# Altium schematic sheet Memory.SchDoc
size A4; SheetNumber: 7; SheetTotal: 9
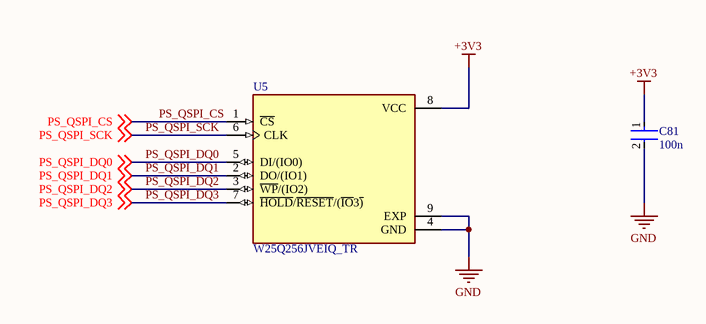
[diagram p0: Memory.SchDoc]

## Parts
C81  100n  [FP-CC0603-DA-MFG]
U5  W25Q256JVEIQ_TR  [SON127P600X800X80-9N]

## Nets
+3V3: C81.1 U5.8(VCC)
GND: C81.2 U5.4(GND) U5.9(EXP)
PS_QSPI_CS: U5.1(~{CS}) ; off-sheet PS_QSPI_CS
PS_QSPI_DQ0: U5.5(DI/(IO0)) ; off-sheet PS_QSPI_DQ0
PS_QSPI_DQ1: U5.2(DO/(IO1)) ; off-sheet PS_QSPI_DQ1
PS_QSPI_DQ2: U5.3(~{WP}/(IO2)) ; off-sheet PS_QSPI_DQ2
PS_QSPI_DQ3: U5.7(~{HOLD}/~{RESET}/(~{IO}3~{)}) ; off-sheet PS_QSPI_DQ3
PS_QSPI_SCK: U5.6(CLK) ; off-sheet PS_QSPI_SCK

## Library data of the parts
C81 = CMP-2100-03601-2: CAP CER 0.1UF 50V X7R 0603; Manufacturer: YAGEO; Manufacturer Part Number: CC0603KRX7R9BB104; Material: Ceramic; Capacitance: 100 nF; Temperature Coefficient: 15%; Tolerance: 0.1; Value: 100 nF; Height: 0.9mm; Voltage: 50 V; ComponentLink2Description: Datasheet; Device Class L2: Capacitors; Temperature Range High: +125°C; Category: Cap; Footprint Url: http://www.yageo.com/exep/pages/download/literatures/UPY-C_GEN_24.pdf; ComponentLink2URL: http://www.yageo.com/documents/recent/UPY-GPHC_X7R_6.3V-to-50V_18.pdf; Package: CC0603-DA; Temperature: -55°C to +125°C; Voltage Rating: 50 V; Temperature Characteristic: X7R; Device Class L1: Passive Components; Temperature Range Low: -55°C; RoHS: TRUE; Automotive: No; Device Class L3: Ceramic Capacitors; Octopart: https://octopart.com/cc0603krx7r9bb104-yageo-42244635; Mouser Description: Multilayer Ceramic Capacitor, CC Series, 0.1 - F, - 10%, X7R, 50 V, 0603 [1608 Metric]; Lead Free: Yes; Digikey Description: CAP CER 0.1UF 50V X7R 0603
U5 = W25Q256JVEIQ_TR: FLASH - NOR Memory IC 256Mb (32M x 8) SPI - Quad I/O 133 MHz 8-WSON (8x6); MP: W25Q256JVEIQ TR; MF: Winbond; Price: None; Purchase-URL: https://pricing.snapeda.com/search/part/W25Q256JVEIQ TR/?ref=eda; Package: WSON-8 Winbond; Check_prices: https://www.snapeda.com/parts/W25Q256JVEIQ%20TR/Winbond+Electronics/view-part/?ref=eda; Value: *; Availability: In Stock; SnapEDA_Link: https://www.snapeda.com/parts/W25Q256JVEIQ%20TR/Winbond+Electronics/view-part/?ref=snap